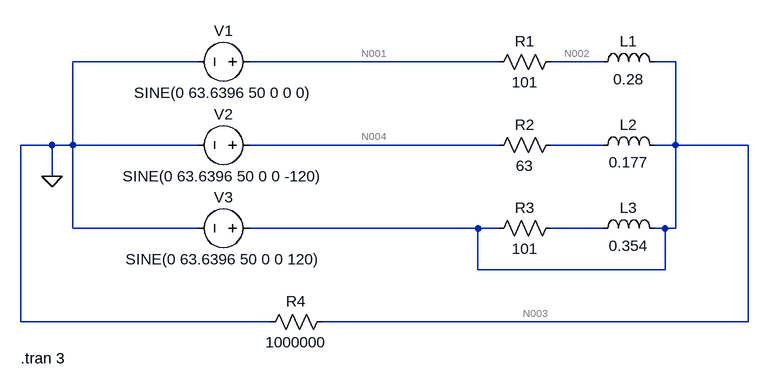
[diagram p0: schematic p1-7.asc]
p1-7.asc, the LTspice schematic file:
Version 4.1
SHEET 1 880 680
WIRE -96 96 -288 96
WIRE 368 96 -16 96
WIRE 528 96 448 96
WIRE 640 96 608 96
WIRE -320 224 -368 224
WIRE -288 224 -288 96
WIRE -288 224 -320 224
WIRE -96 224 -288 224
WIRE 368 224 -16 224
WIRE 528 224 448 224
WIRE 640 224 640 96
WIRE 640 224 608 224
WIRE 752 224 640 224
WIRE -320 272 -320 224
WIRE -288 352 -288 224
WIRE -96 352 -288 352
WIRE 336 352 -16 352
WIRE 368 352 336 352
WIRE 528 352 448 352
WIRE 624 352 608 352
WIRE 640 352 640 224
WIRE 640 352 624 352
WIRE 336 416 336 352
WIRE 624 416 624 352
WIRE 624 416 336 416
WIRE -368 496 -368 224
WIRE 16 496 -368 496
WIRE 752 496 752 224
WIRE 752 496 96 496
FLAG -320 272 0
SYMBOL voltage 0 96 R90
WINDOW 0 -32 56 VBottom 2
WINDOW 3 32 56 VTop 2
WINDOW 123 0 0 Left 0
WINDOW 39 0 0 Left 0
SYMATTR InstName V1
SYMATTR Value SINE(0 63.6396 50 0 0 0)
SYMBOL voltage 0 224 R90
WINDOW 0 -32 56 VBottom 2
WINDOW 3 32 56 VTop 2
WINDOW 123 0 0 Left 0
WINDOW 39 0 0 Left 0
SYMATTR InstName V2
SYMATTR Value SINE(0 63.6396 50 0 0 -120)
SYMBOL voltage 0 352 R90
WINDOW 0 -32 56 VBottom 2
WINDOW 3 32 56 VTop 2
WINDOW 123 0 0 Left 0
WINDOW 39 0 0 Left 0
SYMATTR InstName V3
SYMATTR Value SINE(0 63.6396 50 0 0 120)
SYMBOL res 464 80 R90
WINDOW 0 0 56 VBottom 2
WINDOW 3 32 56 VTop 2
SYMATTR InstName R1
SYMATTR Value 101
SYMBOL res 464 208 R90
WINDOW 0 0 56 VBottom 2
WINDOW 3 32 56 VTop 2
SYMATTR InstName R2
SYMATTR Value 63
SYMBOL res 464 336 R90
WINDOW 0 0 56 VBottom 2
WINDOW 3 32 56 VTop 2
SYMATTR InstName R3
SYMATTR Value 101
SYMBOL ind 512 112 R270
WINDOW 0 32 56 VTop 2
WINDOW 3 5 56 VBottom 2
SYMATTR InstName L1
SYMATTR Value 0.28
SYMATTR SpiceLine Rser=0
SYMBOL ind 512 240 R270
WINDOW 0 32 56 VTop 2
WINDOW 3 5 56 VBottom 2
SYMATTR InstName L2
SYMATTR Value 0.177
SYMATTR SpiceLine Rser=0
SYMBOL ind 512 368 R270
WINDOW 0 32 56 VTop 2
WINDOW 3 5 56 VBottom 2
SYMATTR InstName L3
SYMATTR Value 0.354
SYMATTR SpiceLine Rser=0
SYMBOL res 112 480 R90
WINDOW 0 0 56 VBottom 2
WINDOW 3 32 56 VTop 2
SYMATTR InstName R4
SYMATTR Value 1000000
TEXT -368 552 Left 2 !.tran 3

The netlist it stands for:
* p1-7.asc
V1 N001 0 SINE(0 63.6396 50 0 0 0)
V2 N004 0 SINE(0 63.6396 50 0 0 -120)
V3 N003 0 SINE(0 63.6396 50 0 0 120)
R1 N002 N001 101
R2 N005 N004 63
R3 N006 N003 101
L1 N002 N003 0.28 Rser=0
L2 N005 N003 0.177 Rser=0
L3 N006 N003 0.354 Rser=0
R4 N003 0 1000000
.tran 3
.backanno
.end

* Results of the author's LTspice run, read from the files saved beside the schematic
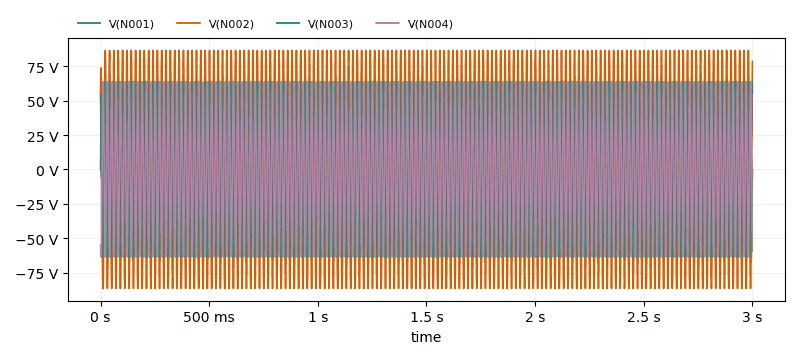
[diagram p1: Transient Analysis of p1-7.asc, plotted from the saved traces]
* Transient Analysis, 1 run:
*   V(N001): min -63.51 V, max 63.52 V, average 36.81 µV, rms 45.01 V, last 0 V
*   V(N002): min -86.78 V, max 86.55 V, average -21.37 mV, rms 61.31 V, last 78.47 V
*   V(N003): min -63.64 V, max 63.64 V, average 216.6 µV, rms 45 V, last 55.11 V
*   V(N004): min -63.63 V, max 63.62 V, average -253.4 µV, rms 44.99 V, last -55.11 V